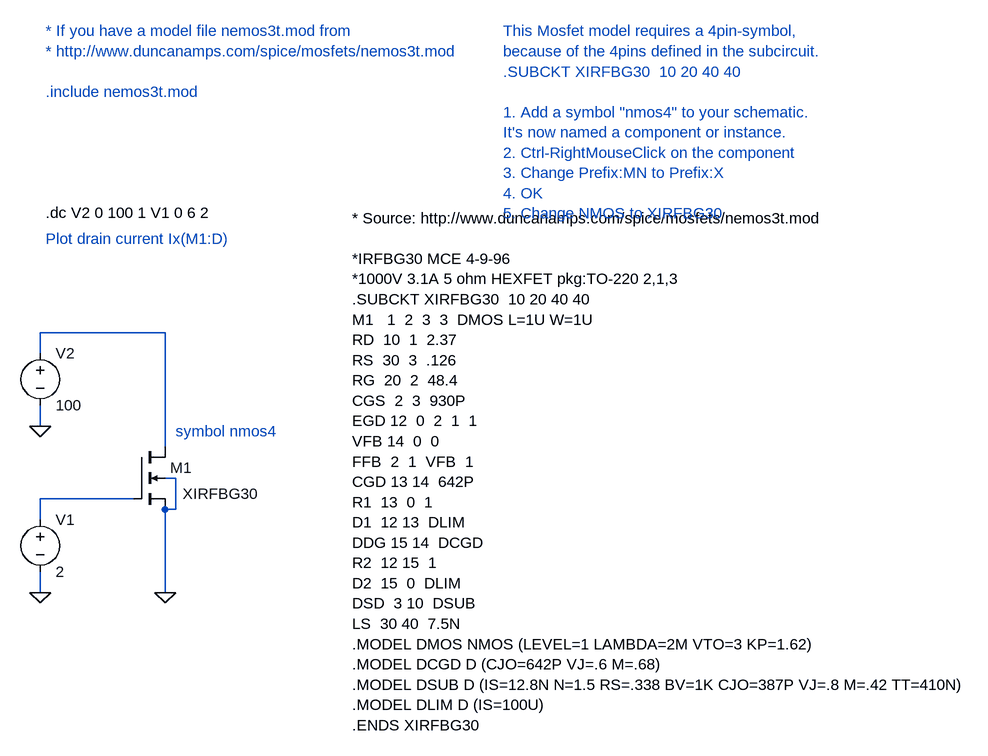
[diagram p0: schematic IRFBG30_test.asc]
IRFBG30_test.asc, the LTspice schematic file:
Version 4
SHEET 1 1624 724
WIRE 80 144 80 112
WIRE 80 256 80 224
WIRE 80 400 80 368
WIRE 80 512 80 480
WIRE 224 368 80 368
WIRE 272 112 80 112
WIRE 272 288 272 112
WIRE 272 512 272 384
WIRE 288 336 272 336
WIRE 288 384 272 384
WIRE 288 384 288 336
FLAG 272 512 0
FLAG 80 256 0
FLAG 80 512 0
SYMBOL voltage 80 384 R0
SYMATTR InstName V1
SYMATTR Value 2
SYMBOL voltage 80 128 R0
SYMATTR InstName V2
SYMATTR Value 100
SYMBOL nmos4 224 288 R0
WINDOW 3 75 72 Left 0
SYMATTR InstName M1
SYMATTR Value XIRFBG30
SYMATTR Prefix X
TEXT 560 -64 Left 0 !* Source: http://www.duncanamps.com/spice/mosfets/nemos3t.mod\n \n*IRFBG30 MCE 4-9-96\n*1000V 3.1A 5 ohm HEXFET pkg:TO-220 2,1,3\n.SUBCKT XIRFBG30  10 20 40 40\nM1   1  2  3  3  DMOS L=1U W=1U\nRD  10  1  2.37\nRS  30  3  .126\nRG  20  2  48.4\nCGS  2  3  930P\nEGD 12  0  2  1  1\nVFB 14  0  0\nFFB  2  1  VFB  1\nCGD 13 14  642P\nR1  13  0  1\nD1  12 13  DLIM\nDDG 15 14  DCGD\nR2  12 15  1\nD2  15  0  DLIM\nDSD  3 10  DSUB\nLS  30 40  7.5N\n.MODEL DMOS NMOS (LEVEL=1 LAMBDA=2M VTO=3 KP=1.62)\n.MODEL DCGD D (CJO=642P VJ=.6 M=.68)\n.MODEL DSUB D (IS=12.8N N=1.5 RS=.338 BV=1K CJO=387P VJ=.8 M=.42 TT=410N)\n.MODEL DLIM D (IS=100U)\n.ENDS XIRFBG30
TEXT 792 -352 Left 0 ;This Mosfet model requires a 4pin-symbol,\nbecause of the 4pins defined in the subcircuit.\n.SUBCKT XIRFBG30  10 20 40 40\n \n1. Add a symbol "nmos4" to your schematic. \nIt's now named a component or instance.\n2. Ctrl-RightMouseClick on the component \n3. Change Prefix:MN to Prefix:X\n4. OK\n5. Change NMOS to XIRFBG30
TEXT 88 -72 Left 0 !.dc V2 0 100 1 V1 0 6 2
TEXT 88 -32 Left 0 ;Plot drain current Ix(M1:D)
TEXT 88 -352 Left 0 ;* If you have a model file nemos3t.mod from \n* http://www.duncanamps.com/spice/mosfets/nemos3t.mod\n \n.include nemos3t.mod
TEXT 288 264 Left 0 ;symbol nmos4

The netlist it stands for:
* IRFBG30_test.asc
V1 N002 0 2
V2 N001 0 100
XM1 N001 N002 0 0 XIRFBG30  ; pins D G S B
* Source: http://www.duncanamps.com/spice/mosfets/nemos3t.mod
*IRFBG30 MCE 4-9-96
*1000V 3.1A 5 ohm HEXFET pkg:TO-220 2,1,3
.SUBCKT XIRFBG30  10 20 40 40
M1   1  2  3  3  DMOS L=1U W=1U
RD  10  1  2.37
RS  30  3  .126
RG  20  2  48.4
CGS  2  3  930P
EGD 12  0  2  1  1
VFB 14  0  0
FFB  2  1  VFB  1
CGD 13 14  642P
R1  13  0  1
D1  12 13  DLIM
DDG 15 14  DCGD
R2  12 15  1
D2  15  0  DLIM
DSD  3 10  DSUB
LS  30 40  7.5N
.MODEL DMOS NMOS (LEVEL=1 LAMBDA=2M VTO=3 KP=1.62)
.MODEL DCGD D (CJO=642P VJ=.6 M=.68)
.MODEL DSUB D (IS=12.8N N=1.5 RS=.338 BV=1K CJO=387P VJ=.8 M=.42 TT=410N)
.MODEL DLIM D (IS=100U)
.ENDS XIRFBG30
* This Mosfet model requires a 4pin-symbol,
* because of the 4pins defined in the subcircuit.
* .SUBCKT XIRFBG30  10 20 40 40
* 1. Add a symbol "nmos4" to your schematic.
* It's now named a component or instance.
* 2. Ctrl-RightMouseClick on the component
* 3. Change Prefix:MN to Prefix:X
* 4. OK
* 5. Change NMOS to XIRFBG30
.dc V2 0 100 1 V1 0 6 2
* Plot drain current Ix(M1:D)
* * If you have a model file nemos3t.mod from
* * http://www.duncanamps.com/spice/mosfets/nemos3t.mod
* .include nemos3t.mod
* symbol nmos4
.backanno
.end